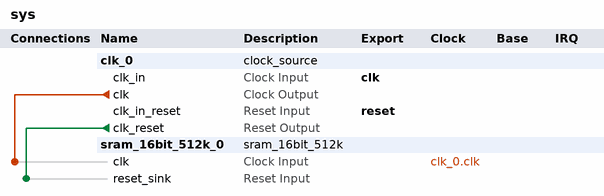
[diagram p0: system contents]
# Platform Designer (Qsys) system sys, Cyclone II EP2C35F672C6
# Parameters at their usual value, and those the tool derives, are not listed.
package require -exact qsys 13.0
create_system sys
set_project_property DEVICE_FAMILY {Cyclone II}
set_project_property DEVICE EP2C35F672C6

add_instance clk_0 clock_source 13.0
set_instance_parameter_value clk_0 clockFrequency 50000000

add_instance sram_16bit_512k_0 sram_16bit_512k 1.0.3

# connections
add_connection clk_0.clk sram_16bit_512k_0.clk clock
add_connection clk_0.clk_reset sram_16bit_512k_0.reset_sink reset

# exported interfaces
add_interface clk clock sink
set_interface_property clk EXPORT_OF clk_0.clk_in
add_interface reset reset sink
set_interface_property reset EXPORT_OF clk_0.clk_in_reset

set_interconnect_requirement {$system} qsys_mm.clockCrossingAdapter HANDSHAKE
set_interconnect_requirement {$system} qsys_mm.maxAdditionalLatency 1

save_system sys.qsys
